# Altium schematic sheet BMS.SchDoc: BMS
size 279 x 215 mm; Engineer: Ari Wasch; Revision: 2; SheetNumber: 1; SheetTotal: 2
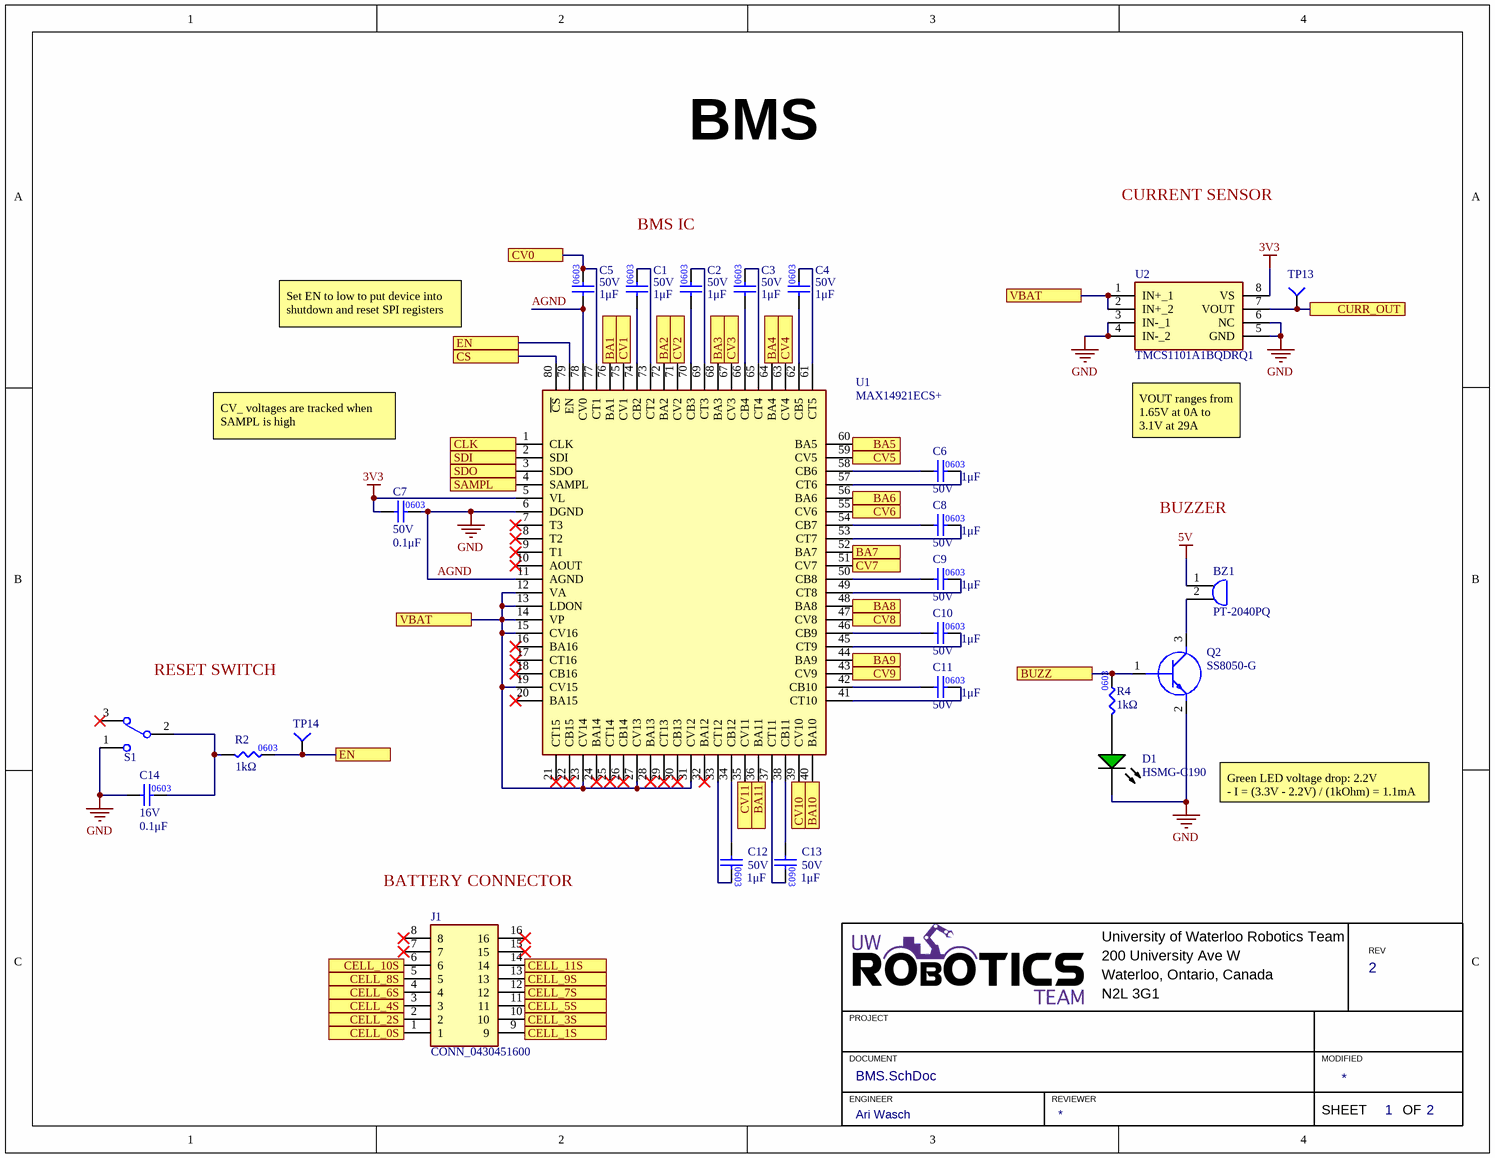
[diagram p0: BMS.SchDoc]

## Parts
BZ1  PT-2040PQ  [PT2040PQ]
C1  value 1μF  Voltage Rating: 50V  [CAP0603]  (hidden comment: CAP_1uF_50V_0603)
C2  value 1μF  Voltage Rating: 50V  [CAP0603]  (hidden comment: CAP_1uF_50V_0603)
C3  value 1μF  Voltage Rating: 50V  [CAP0603]  (hidden comment: CAP_1uF_50V_0603)
C4  value 1μF  Voltage Rating: 50V  [CAP0603]  (hidden comment: CAP_1uF_50V_0603)
C5  value 1μF  Voltage Rating: 50V  [CAP0603]  (hidden comment: CAP_1uF_50V_0603)
C6  value 1μF  Voltage Rating: 50V  [CAP0603]  (hidden comment: CAP_1uF_50V_0603)
C7  value 0.1μF  Voltage Rating: 50V  [CAP0603]  (hidden comment: CAP_0.1uF_50V_0603)
C8  value 1μF  Voltage Rating: 50V  [CAP0603]  (hidden comment: CAP_1uF_50V_0603)
C9  value 1μF  Voltage Rating: 50V  [CAP0603]  (hidden comment: CAP_1uF_50V_0603)
C10  value 1μF  Voltage Rating: 50V  [CAP0603]  (hidden comment: CAP_1uF_50V_0603)
C11  value 1μF  Voltage Rating: 50V  [CAP0603]  (hidden comment: CAP_1uF_50V_0603)
C12  value 1μF  Voltage Rating: 50V  [CAP0603]  (hidden comment: CAP_1uF_50V_0603)
C13  value 1μF  Voltage Rating: 50V  [CAP0603]  (hidden comment: CAP_1uF_50V_0603)
C14  value 0.1μF  Voltage Rating: 16V  [CAP0603]  (hidden comment: CAP_0.1uF_16V_0603)
D1  HSMG-C190  [AVAG-HSMX-C190_V]
J1  CONN_0430451600  [0430451600]
Q2  Manufacturer_Part_Number: SS8050-G  [SOT23-3]  (hidden comment: NPN_40V_1.5A)
R2  value 1kΩ  [RES0603]  (hidden comment: RES_1kΩ_0603_5%)
R4  value 1kΩ  [RES0603]  (hidden comment: RES_1kΩ_0603_5%)
S1  SW_TOGGLE_SPDT  [100SP1T1B4M2QE]  (value not drawn)
TP13  TESTPOINT_1MM_SQUARE  [TESTPOINT_SQUARE_1MM]  (value not drawn)  (no BOM)
TP14  TESTPOINT_1MM_SQUARE  [TESTPOINT_SQUARE_1MM]  (value not drawn)  (no BOM)
U1  MAX14921ECS+  [QFP50P1400X1400X120-80N]
U2  TMCS1101A1BQDRQ1  [SOIC127P600X175-8N]

## Ports
BA1, BA2, BA3, BA4, BA5, BA6, BA7, BA8, BA9, BA10, BA11, BUZZ, CELL_0S, CELL_1S, CELL_2S, CELL_3S, CELL_4S, CELL_5S, CELL_6S, CELL_7S, CELL_8S, CELL_9S, CELL_10S, CELL_11S, CLK, CS, CURR_OUT, CV0, CV1, CV2, CV3, CV4, CV5, CV6, CV7, CV8, CV9, CV10, CV11, EN, SAMPL, SDI, SDO, VBAT

## Nets
3V3: C7.1 U1.5(VL) U2.8(VS)
5V: BZ1.1
AGND: C5.1 C7.2 C14.1 D1.2(K) Q2.2(E) S1.1 U1.6(DGND) U1.11(AGND) U1.78(CV0) U2.3(IN-_1) U2.4(IN-_2) U2.5(GND) U2.6(NC)  [also labelled GND]
BA1: U1.76(BA1) ; port BA1
BA2: U1.72(BA2) ; port BA2
BA3: U1.68(BA3) ; port BA3
BA4: U1.64(BA4) ; port BA4
BA5: U1.60(BA5) ; port BA5
BA6: U1.56(BA6) ; port BA6
BA7: U1.52(BA7) ; port BA7
BA8: U1.48(BA8) ; port BA8
BA9: U1.44(BA9) ; port BA9
BA10: U1.40(BA10) ; port BA10
BA11: U1.36(BA11) ; port BA11
BUZZ: Q2.1(B) R4.2 ; port BUZZ
CELL_0S: J1.1 ; port CELL_0S
CELL_1S: J1.9 ; port CELL_1S
CELL_2S: J1.2 ; port CELL_2S
CELL_3S: J1.10 ; port CELL_3S
CELL_4S: J1.3 ; port CELL_4S
CELL_5S: J1.11 ; port CELL_5S
CELL_6S: J1.4 ; port CELL_6S
CELL_7S: J1.12 ; port CELL_7S
CELL_8S: J1.5 ; port CELL_8S
CELL_9S: J1.13 ; port CELL_9S
CELL_10S: J1.6 ; port CELL_10S
CELL_11S: J1.14 ; port CELL_11S
CLK: U1.1(CLK) ; port CLK
CS: U1.80(~{CS}) ; port CS
CURR_OUT: TP13.1(=value) U2.7(VOUT) ; port CURR_OUT
CV0: C5.2 U1.77(CT1) ; port CV0
CV1: U1.75(CV1) ; port CV1
CV2: U1.71(CV2) ; port CV2
CV3: U1.67(CV3) ; port CV3
CV4: U1.63(CV4) ; port CV4
CV5: U1.59(CV5) ; port CV5
CV6: U1.55(CV6) ; port CV6
CV7: U1.51(CV7) ; port CV7
CV8: U1.47(CV8) ; port CV8
CV9: U1.43(CV9) ; port CV9
CV10: U1.39(CV10) ; port CV10
CV11: U1.35(CV11) ; port CV11
EN: R2.2 TP14.1(=value) U1.79(EN) ; port EN
SAMPL: U1.4(SAMPL) ; port SAMPL
SDI: U1.2(SDI) ; port SDI
SDO: U1.3(SDO) ; port SDO
VBAT: U1.12(VA) U1.13(LDON) U1.14(VP) U1.15(CV16) U1.19(CV15) U1.23(CV14) U1.27(CV13) U1.31(CV12) U2.1(IN+_1) U2.2(IN+_2) ; port VBAT
NetBZ1_2: BZ1.2 Q2.3(C)
NetC1_1: C1.1 U1.74(CB2)
NetC1_2: C1.2 U1.73(CT2)
NetC2_1: C2.1 U1.70(CB3)
NetC2_2: C2.2 U1.69(CT3)
NetC3_1: C3.1 U1.66(CB4)
NetC3_2: C3.2 U1.65(CT4)
NetC4_1: C4.1 U1.62(CB5)
NetC4_2: C4.2 U1.61(CT5)
NetC6_1: C6.1 U1.58(CB6)
NetC6_2: C6.2 U1.57(CT6)
NetC8_1: C8.1 U1.54(CB7)
NetC8_2: C8.2 U1.53(CT7)
NetC9_1: C9.1 U1.50(CB8)
NetC9_2: C9.2 U1.49(CT8)
NetC10_1: C10.1 U1.46(CB9)
NetC10_2: C10.2 U1.45(CT9)
NetC11_1: C11.1 U1.42(CB10)
NetC11_2: C11.2 U1.41(CT10)
NetC12_1: C12.1 U1.34(CB12)
NetC12_2: C12.2 U1.33(CT12)
NetC13_1: C13.1 U1.38(CB11)
NetC13_2: C13.2 U1.37(CT11)
NetC14_2: C14.2 R2.1 S1.2
NetD1_1: D1.1(A) R4.1

Not connected (* = marked no-connect by the designer): J1 7* 8* 15* 16*; S1 3*; U1 7(T3)* 8(T2)* 9(T1)* 10(AOUT)* 16(BA16)* 17(CT16)* 18(CB16)* 20(BA15)* 21(CT15)* 22(CB15)* 24(BA14)* 25(CT14)* 26(CB14)* 28(BA13)* 29(CT13)* 30(CB13)* 32(BA12)*

## Notes on the sheet
- BMS IC
- CURRENT SENSOR
- Set EN to low to put device into shutdown and reset SPI registers
- CV_ voltages are tracked when SAMPL is high
- (near U2) VOUT ranges from 1.65V at 0A to 3.1V at 29A
- BUZZER
- (near S1) RESET SWITCH
- Green LED voltage drop: 2.2V
  - I = (3.3V - 2.2V) / (1kOhm) = 1.1mA
- (near J1) BATTERY CONNECTOR
- University of Waterloo Robotics Team
- 200 University Ave W
- REV
- PROJECT
- Waterloo, Ontario, Canada
- N2L 3G1
- DOCUMENT
- ENGINEER
- REVIEWER
- MODIFIED
- SHEET
- OF
- (in symbol CAP_1uF_50V_0603) 0603

## Library data of the parts
BZ1 = PT-2040PQ: Loudspeaker or Buzzer; Manufacturer_Name: Mallory Sonalert; Datasheet Link: https://datasheet.datasheetarchive.com/originals/distributors/SFDatasheet-1/sf-00027599.pdf; Height: 9.4mm; Manufacturer_Part_Number: PT-2040PQ; Mouser Part Number: 539-PT2040PQ; Mouser Price/Stock: https://www.mouser.co.uk/ProductDetail/Mallory-Sonalert/PT-2040PQ?qs=l%2Fkuw%2F8%252BD9j2AVf7eGaf%252BA%3D%3D
C1-C6 C8-C13 = CAP_1uF_50V_0603: CAP CER 1UF 50V X6S 0603; Manufacturer Part Number 1: C1608X6S1H105K080AC; Manufacturer 1: TDK Corporation; Supplier Part Number 1: 445-7424-1-ND; Supplier 1: Digi-Key; Dielectric: X6S
C7 = CAP_0.1uF_50V_0603: CAP CER 0.1UF 50V X7R 0603; Manufacturer Part Number 1: CC0603KRX7R9BB104; Manufacturer 1: Yageo; Package/Footprint: 0603; Supplier Part Number 1: 311-1344-1-ND; Supplier 1: Digi-Key; Mounting Type: SMD; Dielectric: X7R
C14 = CAP_0.1uF_16V_0603: CAP CER 0.1UF 16V X7R 0603; Manufacturer Part Number 1: CC0603KRX7R7BB104; Manufacturer 1: Yageo; Package/Footprint: 0603; Supplier Part Number 1: 311-1088-1-ND; Supplier 1: Digi-Key; Dielectric: X7R; LCSC Number: C108079
D1 = CMP-1744-00002-1: Chip LED, Green, 2.2 V, -40 to 85 degC, 2-Pin SMD, RoHS, Tape and Reel; Frequency: 400 KHz; Max Supply Voltage: 5.5 V; Access Time: 3500 ns; Clock Frequency: 100 KHz; Case\Package: SOIC; Density: 32 kb; Nominal Supply Current: 2 mA; Interface: Serial; Min Supply Voltage: 1.7 V; Packaging: Tape and Reel; PackageReference: HSMX-C190; ComponentLink2URL: http://docs.avagotech.com/docs/AV02-0551EN; RoHSCompliant: true; Pins: 8; REACH SVHC: No SVHC; Max Operating Temperature: 85 degC; Width: 4 mm; Radiation Hardening: No; Package Quantity: 3000; ComponentLink3Description: Package Specification; ComponentLink1Description: Manufacturer URL; Min Operating Temperature: -40 degC; PackageDescription: 2-Pin Surface Mount Device, Body 1.6 x 0.8 mm, Height 0.9 mm; Max Clock Frequency: 100 KHz; Height: 1.5 mm; ComponentLink1URL: http://www.avagotech.com/; DatasheetVersion: Mar-12; ComponentLink2Description: Datasheet; Mount: Surface Mount; Length: 5 mm; ComponentLink3URL: http://www.fairchildsemi.com/dwg/MA/MA03D.pdf; LCSC Number: C188729
J1 = CONN_0430451600: Connector 16 Pin AJX; Manufacturer_Name: Molex; Datasheet Link: https://www.molex.com/pdm_docs/sd/430451600_sd.pdf; Height: 9.02mm; Manufacturer_Part_Number: 0430451600; Arrow Part Number: 0430451600; Arrow Price/Stock: https://www.arrow.com/en/products/0430451600/molex
Q2 = NPN_40V_1.5A: TRANS NPN 40V 1.5A SOT23; Manufacturer_Name: Comchip Technology; Datasheet Link: https://datasheet.datasheetarchive.com/originals/distributors/DKDS-12/229454.pdf; Height: 1.15mm; Mouser Part Number: 750-SS8050-G; Mouser Price/Stock: https://www.mouser.co.uk/ProductDetail/Comchip-Technology/SS8050-G?qs=LLUE9lz1YbcHg%252BWLMAtcrQ%3D%3D; Arrow Part Number: SS8050-G; Arrow Price/Stock: https://www.arrow.com/en/products/ss8050-g/comchip-technology?region=nac
R2 R4 = RES_1kΩ_0603_5%: RES 1K OHM 5% 1/10W 0603; Manufacturer 1: Yageo; Manufacturer Part Number 1: RC0603JR-071KL; Package/Footprint: 0603; Supplier Part Number 1: 311-1.0KGRCT-ND; Supplier 1: Digi-Key; Mounting Type: SMD; LCSC Number: C14676
S1 = SW_TOGGLE_SPDT: SWITCH TOGGLE SPDT 5A 120V; Manufacturer 1: E-Switch; Voltage Rating (DC): 28V; Package/Footprint: TH; Supplier 1: Digi-Key; Mounting Type: TH; Throw Configuration: SPDT; Supplier Part Number 1: EG2355-ND; Manufacturer Part Number 1: 100SP1T1B4M2QE
TP13 = TESTPOINT_1MM_SQUARE: CURR_OUT
TP14 = TESTPOINT_1MM_SQUARE: TESTPOINT 1MM SQUARE
U1 = MAX14921ECS+: IC 16s BMS; Manufacturer_Name: Maxim Integrated; Datasheet Link: http://pdfserv.maximintegrated.com/package_dwgs/21-0072.PDF; Height: 1.2mm; Manufacturer_Part_Number: MAX14921ECS+; Mouser Part Number: 700-MAX14921ECS+; Mouser Price/Stock: https://www.mouser.co.uk/ProductDetail/Maxim-Integrated/MAX14921ECS%2b?qs=Vwh6e7toGLhlnKi5DjCusg%3D%3D
U2 = TMCS1101A1BQDRQ1: Hall-Effect Current Sensor; Manufacturer_Name: Texas Instruments; Datasheet Link: https://www.ti.com/lit/ds/symlink/tmcs1101-q1.pdf?HQS=dis-dk-null-digikeymode-dsf-pf-null-wwe&ts=1636812075055&ref_url=https%253A%252F%252Fwww.digikey.be%252F; Height: 1.75mm; Manufacturer_Part_Number: TMCS1101A1BQDRQ1; Mouser Part Number: 595-TMCS1101A3BQDRQ1; Mouser Price/Stock: https://www.mouser.co.uk/ProductDetail/Texas-Instruments/TMCS1101A3BQDRQ1?qs=QNEnbhJQKvb740%252BlrUS3Og%3D%3D; Arrow Part Number: TMCS1101A3BQDRQ1; Arrow Price/Stock: https://www.arrow.com/en/products/tmcs1101a3bqdrq1/texas-instruments?region=nac